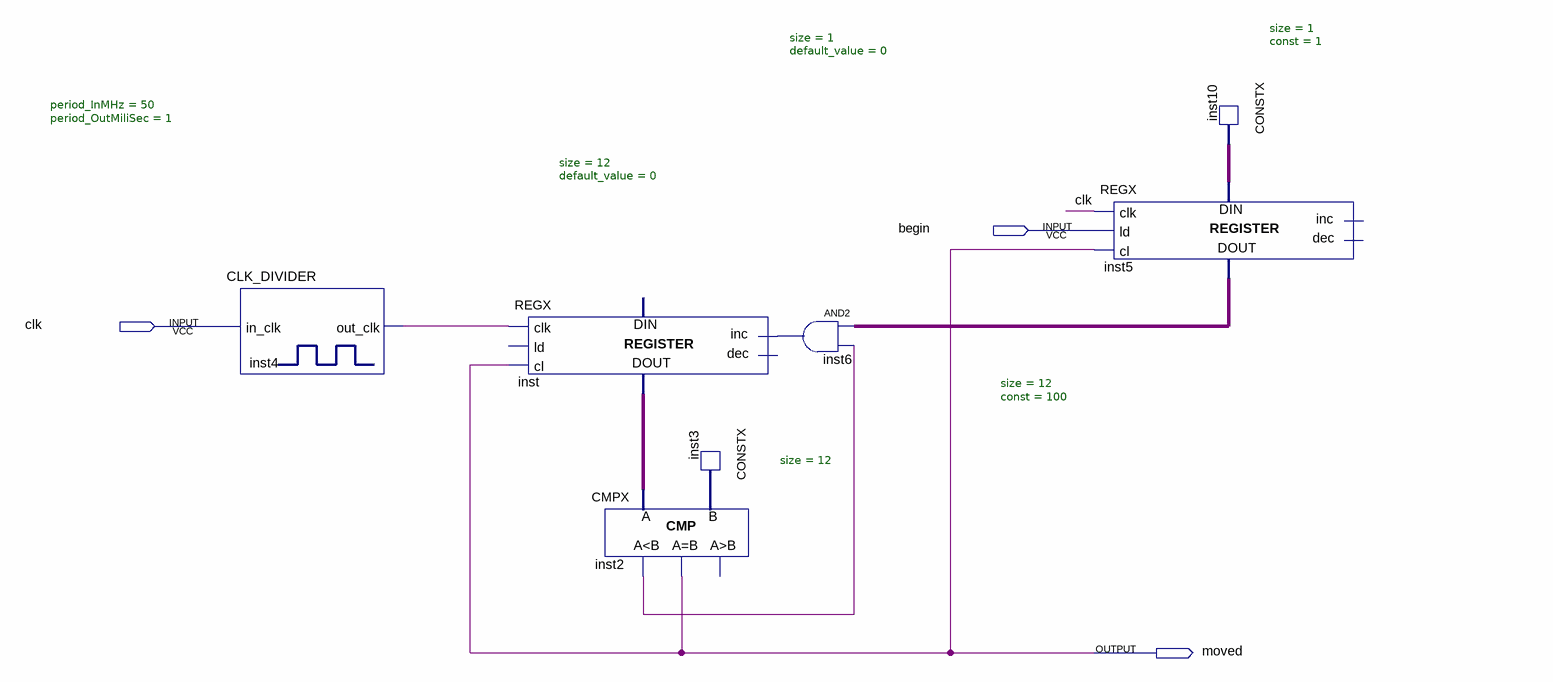
[diagram p0: schematic sheet]
// Quartus schematic Delay.bdf as structural Verilog: 7 symbols, 3 pins
module Delay (
  input  \begin ,
  input  clk,
  output moved
);

  wire inst2_ls, inst4_out_clk, inst5_data_out, inst6_out, inst10_data;
  wire [11:0] inst3_data, inst_data_out;

  CLK_DIVIDER #(.period_InMHz(50), .period_OutMiliSec(1)) inst4 (.in_clk(clk), .out_clk(inst4_out_clk));
  REGX #(.size(12), .default_value(0)) inst (
    .clk(inst4_out_clk), .cl(moved), .inc(inst6_out), .data_out(inst_data_out));  // open: ld, dec, data_in
  CMPX #(.size(12)) inst2 (.A(inst_data_out), .B(inst3_data), .ls(inst2_ls), .eq(moved));  // open: gr
  CONSTX #(.size(12), .\const (100)) inst3 (.data(inst3_data));
  and inst6 (inst6_out, inst5_data_out, inst2_ls);
  REGX #(.size(1), .default_value(0)) inst5 (
    .clk(clk), .ld(\begin ), .cl(moved), .data_in(inst10_data), .data_out(inst5_data_out));  // open: inc, dec
  CONSTX #(.size(1), .\const (1)) inst10 (.data(inst10_data));
endmodule
